# Altium schematic sheet power.SchDoc
size A4
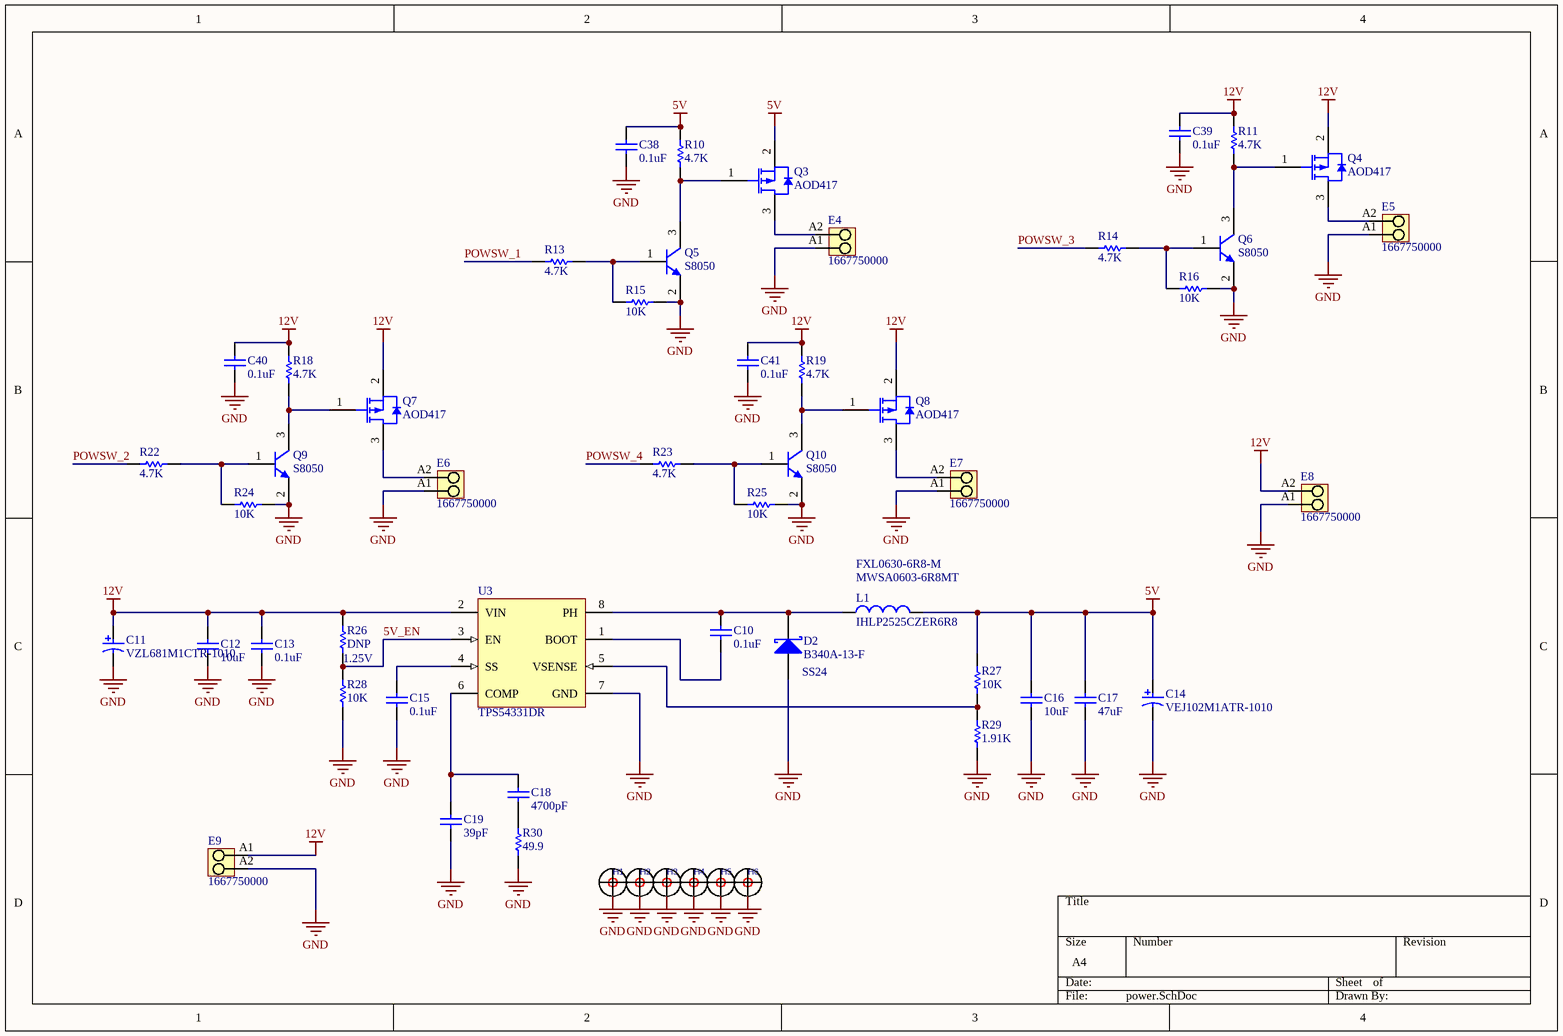
[diagram p0: power.SchDoc]

## Parts
C10  0.1uF  [CAPC0603(1608)100_L]
C11  VZL681M1CTR-1010  [PNSC-SVP-F12_L]
C12  10uF  [CAPC0805(2012)145_L]
C13  0.1uF  [CAPC0603(1608)100_L]
C14  VEJ102M1ATR-1010  [PNSC-SVP-F12_L]
C15  0.1uF  [CAPC0603(1608)100_L]
C16  10uF  [CAPC0805(2012)145_L]
C17  47uF  [CAPC1206(3216)150_L]
C18  4700pF  [CAPC0603(1608)100_L]
C19  39pF  [CAPC0603(1608)100_L]
C38  0.1uF  [CAPC0603(1608)100_L]
C39  0.1uF  [CAPC0603(1608)100_L]
C40  0.1uF  [CAPC0603(1608)100_L]
C41  0.1uF  [CAPC0603(1608)100_L]
D2  B340A-13-F  [DIOD-SMA-2_V]
E4  1667750000  [LM_3_5_90_02]
E5  1667750000  [LM_3_5_90_02]
E6  1667750000  [LM_3_5_90_02]
E7  1667750000  [LM_3_5_90_02]
E8  1667750000  [LM_3_5_90_02]
E9  1667750000  [LM_3_5_90_02]
H1  HOLE  [HOLE_Φ3_3]  (value not drawn)
H2  HOLE  [HOLE_Φ3_3]  (value not drawn)
H3  HOLE  [HOLE_Φ3_3]  (value not drawn)
H4  HOLE  [HOLE_Φ3_3]  (value not drawn)
H5  HOLE  [HOLE_Φ3_3]  (value not drawn)
H6  HOLE  [HOLE_Φ3_3]  (value not drawn)
L1  IHLP2525CZER6R8  [VISH-IHLP2525CZER220M11_V]
Q3  AOD417  [DIOD-TO252-3_V]
Q4  AOD417  [DIOD-TO252-3_V]
Q5  S8050  [KOCN-SOT23-3_L]
Q6  S8050  [KOCN-SOT23-3_L]
Q7  AOD417  [DIOD-TO252-3_V]
Q8  AOD417  [DIOD-TO252-3_V]
Q9  S8050  [KOCN-SOT23-3_L]
Q10  S8050  [KOCN-SOT23-3_L]
R10  4.7K  [RESC0603(1608)_L]
R11  4.7K  [RESC0603(1608)_L]
R13  4.7K  [RESC0603(1608)_L]
R14  4.7K  [RESC0603(1608)_L]
R15  10K  [RESC0603(1608)_L]
R16  10K  [RESC0603(1608)_L]
R18  4.7K  [RESC0603(1608)_L]
R19  4.7K  [RESC0603(1608)_L]
R22  4.7K  [RESC0603(1608)_L]
R23  4.7K  [RESC0603(1608)_L]
R24  10K  [RESC0603(1608)_L]
R25  10K  [RESC0603(1608)_L]
R26  DNP  [RESC0603(1608)_L]
R27  10K  [RESC0603(1608)_L]
R28  10K  [RESC0603(1608)_L]
R29  1.91K  [RESC0603(1608)_L]
R30  49.9  [RESC0603(1608)_L]
U3  TPS54331DR  [D8_N]

## Nets
5V: C14.1 C16.2 C17.2 C38.2 L1.2 Q3.2(SOURCE) R10.1 R27.1
12V: C11.1 C12.2 C13.2 C39.2 C40.2 C41.2 E8.A2 E9.A1 Q4.2(SOURCE) Q7.2(SOURCE) Q8.2(SOURCE) R11.1 R18.1 R19.1 R26.1 U3.2(VIN)
GND: C11.2 C12.1 C13.1 C14.2 C15.1 C16.1 C17.1 C19.1 C38.1 C39.1 C40.1 C41.1 D2.1(A) E4.A1 E5.A1 E6.A1 E7.A1 E8.A1 E9.A2 H1.1 H2.1 H3.1 H4.1 H5.1 H6.1 Q5.2(EMITTER) Q6.2(EMITTER) Q9.2(EMITTER) Q10.2(EMITTER) R15.2 R16.2 R24.2 R25.2 R28.2 R29.2 R30.2 U3.7(GND)
5V_EN: R26.2 R28.1 U3.3(EN)
POWSW_1: R13.1
POWSW_2: R22.1
POWSW_3: R14.1
POWSW_4: R23.1
NetC10_1: C10.1 U3.1(BOOT)
NetC10_2: C10.2 D2.2(K) L1.1 U3.8(PH)
NetC15_2: C15.2 U3.4(SS)
NetC18_1: C18.1 R30.1
NetC18_2: C18.2 C19.2 U3.6(COMP)
NetE4_A2: E4.A2 Q3.3(DRAIN)
NetE5_A2: E5.A2 Q4.3(DRAIN)
NetE6_A2: E6.A2 Q7.3(DRAIN)
NetE7_A2: E7.A2 Q8.3(DRAIN)
NetQ3_1: Q3.1(GATE) Q5.3(COLLECTOR) R10.2
NetQ4_1: Q4.1(GATE) Q6.3(COLLECTOR) R11.2
NetQ5_1: Q5.1(BASE) R13.2 R15.1
NetQ6_1: Q6.1(BASE) R14.2 R16.1
NetQ7_1: Q7.1(GATE) Q9.3(COLLECTOR) R18.2
NetQ8_1: Q8.1(GATE) Q10.3(COLLECTOR) R19.2
NetQ9_1: Q9.1(BASE) R22.2 R24.1
NetQ10_1: Q10.1(BASE) R23.2 R25.1
NetR27_2: R27.2 R29.1 U3.5(VSENSE)

## Notes on the sheet
- (near L1) FXL0630-6R8-M
- (near L1) MWSA0603-6R8MT
- (near R26) 1.25V
- (near D2) SS24

## Library data of the parts
C10 C13 C15 C18 C19 C38-C41 = CMP-1590-00005-1: 0603 (1608 Metric) Chip Capacitor; Case-Metric: 1608; Case-EIA: 0603; PackageReference: CAPC0603(1608)100
C11 = CMP-2000-05494-1: 680uF,16V,-55~105℃; Manufacturer: Lelon; Surface Mount Land Size: 0.406"Lx0.406"W(10.30mmx10.30mm); Online Catalog: OS-CON,SVPSeries; Other Names: P16463TR; Tolerance: ±20%; Lifetime @ Temp.: 2000Hrs@105°C; Polarization: Polar; Ripple Current: 4.72A; Capacitance: 680µF; Operating Temperature: -55°C~105°C; Family: Aluminum Capacitors; Packaging: Tape&Reel(TR); Series: OS-CON,SVP; Package / Case: Radial,Can-SMD; Size / Dimension: 0.394"Dia(10.00mm); Mounting Type: SurfaceMount; Package Description: 2-Pin Surface Mount Device, Body 10.3 x 10.3 mm; Category: Capacitors; Datasheet URL: https://atta.szlcsc.com/upload/public/pdf/source/20171023/C134843_15087477624341052967.pdf; Voltage Rating: 16V; Mounting Technology: SurfaceMount; Standard Package: 400
C12 C16 = CAP_5_1: 0805 (2012 Metric) Chip Capacitor; Case-EIA: 0805; Case-Metric: 2012; PackageReference: CAPC0805(2012)145
C14 = CMP-2000-05494-1: 1000uF,10V,-55~105℃; Manufacturer: Lelon; Surface Mount Land Size: 0.406"Lx0.406"W(10.30mmx10.30mm); Online Catalog: OS-CON,SVPSeries; Other Names: P16463TR; Tolerance: ±20%; Lifetime @ Temp.: 2000Hrs@105°C; Polarization: Polar; Ripple Current: 4.72A; Capacitance: 1000µF; Operating Temperature: -55°C~105°C; Family: Aluminum Capacitors; Packaging: Tape&Reel(TR); Series: OS-CON,SVP; Package / Case: Radial,Can-SMD; Size / Dimension: 0.394"Dia(10.00mm); Mounting Type: SurfaceMount; Package Description: 2-Pin Surface Mount Device, Body 10.3 x 10.3 mm; Category: Capacitors; Datasheet URL: https://atta.szlcsc.com/upload/public/pdf/source/20171023/C134843_15087477624341052967.pdf; Voltage Rating: 10V; Mounting Technology: SurfaceMount; Standard Package: 400
C17 = CAP_5_3: 1206 (3216 Metric) Chip Capacitor; Case-Metric: 3216; Case-EIA: 1206; PackageReference: CAPC1206(3216)150
D2 = CMP-1667-00003-1: Surface Mount Schottky Barrier Rectifier, 40 V, 3 A, -55 to 150 degC, 2-Pin SMA, RoHS, Tape and Reel; Forward Current: 3 A; Forward Voltage: 500 mV; Max Surge Current: 80 A; Peak Reverse Current: 500 uA; Elements: 1; Mounting Technology: Surface Mount; ComponentLink1URL: http://www.diodes.com/; PackageDescription: 2-Pin Surface Mounted Assembly, Body 4.3 x 2.605 mm, Height 2.4 mm; Min Operating Temperature: -55 degC; Mount: Surface Mount; Pins: 2; ComponentLink2URL: http://www.diodes.com/_files/datasheets/ds30891.pdf; PackageReference: SMA-2; Max Operating Temperature: 125 degC; Radiation Hardening: No; Length: 4.6 mm; RoHSCompliant: true; ComponentLink1Description: Manufacturer URL; Height: 2.1 mm; ComponentLink2Description: Datasheet; Packaging: Tape and Reel; Package Quantity: 5000; Case\Package: SMA; DatasheetVersion: Rev. 17 - 2, 09/2015; REACH SVHC: No SVHC; Width: 2.92 mm
E4-E9 = CMP-1559-01728-1: OMNIMATE Signal - series LM; Manufacturer: Weidmueller; Rated_voltage_for_surge_voltage_class_pollution_degree_II_2: 320 V; Rated_current_use_group_B_UL_1059: 10 A; Short_text_for_material: LM 3.50/02/90 3.2SN OR BX; UL_94_flammability_rating: V-2; Solid_min_H05_07_V_U: 0,5 mm²; Pitch_mm: 3,5 mm; Solid_max_H05_07_V_U: 1,5 mm²; Rated_voltage_use_group_B_UL_1059: 300 V; Wire_cross_section_AWG_min_UL_1059: AWG 28; Contact_material: Cu-Leg; Rated_current_min_no_of_poles_TU_20_deg_C: 32 A; Contact_surface: tinned; Mounting_onto_the_PCB: Solder connection; Wire_cross_section_AWG_max_UL_1059: AWG 14; No_of_poles: 2; Pitch_inch: 0,138 inch; Solder_pin_length_mm: 3,2 mm; Side_termination_characteristic: closed side; Insulating_material: PA; Revision: V1; ComponentLink1Description: Manufacturer URL; PartNumber: 1667750000; ComponentLink2URL: http://catalog.weidmueller.com/catalog/Start.do?localeId=en&ObjectID=1667750000; PackageReference: LM_3_5_90_02; Qty: 100 PCS; Colour: Orange; ComponentLink2Description: URL Link1; Packaging: Box; ComponentLink1URL: http://www.weidmueller.com/
H1-H6 = HOLE: CLASS: IC; CAD_APPROVED: Yes; MFG_PN01: TP-105-01-09; MFG_NAME01: COMPONENTS CORPORATION; AGILE_PN: 210-75685; HEIGHT: 4.8 MM; ROHS: Yes
L1 = CMP-2000-06442-1: Low Profile, High Current IHLP(R) Inductor, 6.8 uH, +/- 20%, 2.9 A, -55 to 125 degC, 2-Pin SMD, RoHS, Tape and Reel; Manufacturer: Vishay; Inductance: 22µH; Frequency - Test: 100kHz; Product Training Modules: IHLPInductorSeries; DC Resistance (DCR): 135mOhmMax; Shielding: Shielded; Current Rating: 2.9A; Current - Saturation: 2.5A; Series: IHLP-2525CZ-11; Package Description: 2-Pin Surface Mount Device, Body 6.86 x 6.47 mm; Package Reference: IHLP2525CZER220M11; Size / Dimension: 0.270"Lx0.255"Wx0.118"H(6.86mmx6.47mmx3.00mm); Category: Inductors,Coils,Chokes; Mounting Technology: SurfaceMount; Operating Temperature: -55°C~125°C; Tolerance: ±20%; Manufacturer URL: http://www.vishay.com/; Family: FixedInductors; Standard Package: 2,000; Packaging: Tape&Reel(TR); Mounting Type: SurfaceMount; Package / Case: NonStandard; Datasheet Version: 09/2013; Datasheet URL: https://datasheet.ciiva.com/11798/0900766b8102c935-11798417.pdf
Q3 Q4 Q7 Q8 = CMP-1667-00002-2: P-Channel Enhancement Mode MOSFET, -30V, -25 A, -55 to 150 degC, 3-Pin DPAK (TO252), RoHS, Tape and Reel; Manufacturer: Diodes Inc; DatasheetVersion: Rev. 2-2, 08/2014; Packaging: Tape and Reel; Min Operating Temperature: -55 degC; Package Quantity: 2500; Pins: 3; RoHSCompliant: true; ComponentLink1Description: Manufacturer URL; Mounting Technology: Surface Mount; Mount: Surface Mount; PackageDescription: 3-Pin Transistor Outline, Body 6.1 x 6.575 mm, Pitch 2.286 mm; ComponentLink1URL: http://www.diodes.com/; PackageReference: TO252-3; Length: 6.73 mm; Max Operating Temperature: 150 degC; ComponentLink2Description: Datasheet; Height: 2.39 mm; ComponentLink2URL: http://www.diodes.com/_files/datasheets/ZXMP10A18K.pdf; REACH SVHC: No SVHC
Q5 Q6 Q9 Q10 = CMP-0564-00001-1: NPN Transistor, 0.8 A Collector Current, 3-Pin SOT23, RoHS, Tape and Reel; Manufacturer: Koo Chin; V (BR) CEO (min): 25 V; VCE (sat) (max): 0.6 V; VBE (sat) (max): 1.2 V; IEBO (max): 0.1 uA; V (BR) EBO (min): 5 V; V (BR) CBO (min): 40 V; fT(min): 150 MHz; Packing: Tape and Reel; ComponentLink2URL: http://www.hz-dz.net/UploadFiles/2009812164318190.pdf; ComponentLink3URL: http://galaxycn.com/jsp/upload/S8050.pdf; RoHS: TRUE; ComponentLink2Description: Datasheet; PartNumber: S8050; ComponentLink3Description: Package Specification; DatasheetVersion: 17/08/2009; ComponentLink1URL: http://www.hz-dz.net/; PackageReference: SOT23-3; ICBO (max): 0.1 uA; ICEO (max): 0.1 uA; Mounting Technology: Surface Mount; PackageDescription: 3-Pin Small Out-Line Transistor, Body 1.3 x 2.9 mm, Pitch 0.95 mm; ComponentLink1Description: Manufacturer URL; NPN/PNP: NPN
R10 R11 R13-R16 R18 R19 R22-R30 = RES_3_1: 0603 (1608 Metric) Chip Resistor; Case-Metric: 1608; Case-EIA: 0603; PackageReference: RESC0603(1608)
U3 = CMP-0323-00209-2: Buck Step Down Regulator with 3.5 to 28 V Input and 0.8 to 25 V Output, -40 to 150 degC, 8-Pin SOIC (D), Green (RoHS & no Sb/Br); Manufacturer: Texas Instruments; Vout(Max)(V): 25; SubFamily: Step-Down Regulator; Switch Current Limit(Typ)(A): 3.5; Duty Cycle(Max)(%): 90; Vout(Min)(V): 0.8; Iout(Max)(A): 3; Rating: Catalog; Iq(Typ)(mA): 0.11; Vin(Max)(V): 28; Regulated Outputs(#): 1; PackageDescription: 8-Pin Plastic Small Outline Integrated Circuit, 4.9 x 3.9 mm, Pitch 1.27 mm Pitch; PartNumber: TPS54331DR; DatasheetVersion: SLVS839D; Eco-Plan: Green (RoHS & no Sb/Br); PackageVersion: revM, Jun-2011; ComponentLink3URL: Samples URL:http://www.ti.com/product/tps54331#samples; ComponentLink2Description: Package Specification; ComponentLink3Description: URL Link1; Code_JEDEC: MS-012AA; Mounting Technology: Surface Mount; Topology: Buck; Vin(Min)(V): 3.5; ComponentLink1Description: Datasheet; ComponentLink1URL: http://www.ti.com/general/docs/lit/getliterature.tsp?genericPartNumber=TPS54331&fileType=pdf; ComponentLink2URL: http://www.ti.com/litv/pdf/msoi002j; PackageReference: D8